# EAGLE design radio_rpi (EAGLE 7.5.0)
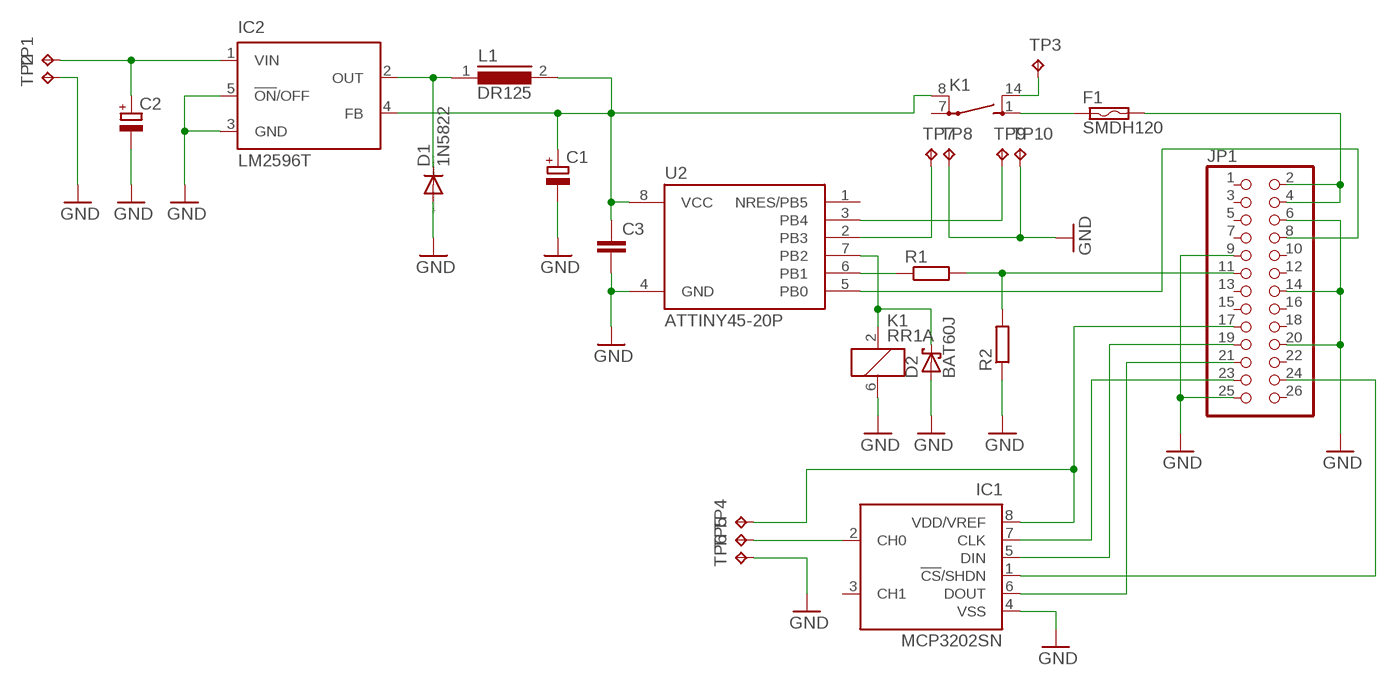
[diagram p0: schematic, sheet 1]

## Parts
C1  CPOL-EUUD-6,3X7,7  [UD-6,3X7,7_NICHICON]
C2  CPOL-EUUD-10X10  [UD-10X10_NICHICON]
C3  C-EUC1206K  [C1206K]
D1  1N5822  1N5624  [DO201-15]
D2  BAT60J  [SOD323_ST]
F1  SMDH120  [SMD050F]
IC1  MCP3202SN  [SO-08]
IC2  LM2596T  [T05D]
JP1  PINHD-2X13  [2X13]
K1  RR1A  [RR1A]
L1  DR125  [DR125]
R1  R-EU_M1206  [M1206]
R2  R-EU_M1206  [M1206]
TP1  TPTP20SQ  [TP20SQ]
TP2  TPTP20SQ  [TP20SQ]
TP3  TPTP20SQ  [TP20SQ]
TP4  TPTP20SQ  [TP20SQ]
TP5  TPTP20SQ  [TP20SQ]
TP6  TPTP20SQ  [TP20SQ]
TP7  TPTP20SQ  [TP20SQ]
TP8  TPTP20SQ  [TP20SQ]
TP9  TPTP20SQ  [TP20SQ]
TP10  TPTP20SQ  [TP20SQ]
U2  ATTINY45-20P  [PDIP08_300MIL]

## Nets
GND: C1.- C2.- C3.2 D1.A D2.A IC1.4(VSS) IC2.3(GND) IC2.5(!ON!/OFF) JP1.6 JP1.9 JP1.14 JP1.20 JP1.25 K1.6 R2.1 TP2.TP TP6.TP TP8.TP TP10.TP U2.4(GND)
N$1: F1.1 K1.1(2:S)
N$2: F1.2 JP1.2 JP1.4
N$3: C1.+ C3.1 IC2.4(FB) K1.8(2:P) L1.2 U2.8(VCC)
N$4: IC1.1(!CS!/SHDN) JP1.24
N$5: IC1.5(DIN) JP1.19
N$6: IC1.8(VDD/VREF) JP1.17 TP4.TP
N$7: IC1.7(CLK) JP1.23
N$8: IC1.2(CH0) TP5.TP
N$9: IC1.6(DOUT) JP1.21
N$10: JP1.8 U2.5(PB0)
N$11: JP1.11 R1.2 R2.2
N$12: D2.C K1.2 U2.7(PB2)
N$13: R1.1 U2.6(PB1)
N$14: K1.14(2:S) TP3.TP
N$15: C2.+ IC2.1(VIN) TP1.TP
N$16: TP7.TP U2.2(PB3)
N$17: D1.C IC2.2(OUT) L1.1
N$18: TP9.TP U2.3(PB4)
Unconnected: IC1.3(CH1) JP1.1 JP1.3 JP1.5 JP1.7 JP1.10 JP1.12 JP1.13 JP1.15 JP1.16 JP1.18 JP1.22 JP1.26 K1.7(2:P) U2.1(NRES/PB5)

## Library data of the parts
C1 C2 = rcl:CPOL-EU: POLARIZED CAPACITOR, European symbol
C3 = rcl:C-EU: CAPACITOR, European symbol
D1 = diode:1N5624: DIODE controlled avalanche rectifier
D2 = diode:BAT60J: Schottky barrier diode Source: www.st.com, BAT60J.pdf
F1 = switch-raychem:SMDH120: PolySwitch (TM) Resettable Device Source: Data sheet <http://www.farnell.com/datasheets/13482.pdf>
IC1 = microchip:MCP3202: 2.7V Dual Channel 12-Bit A/D Converter with SPI Serial Interface Source: http://ww1.microchip.com/downloads/en/DeviceDoc/21034D.pdf; MF: MICROCHIP; MPN: MCP3202-CI/SN; OC_FARNELL: 1196803; OC_NEWARK: 19C7207
IC2 = national-semiconductor:LM2596: SIMPLE SWITCHER® Power Converter 150 kHz 3A Step-Down Voltage Regulator Source: http://www.national.com/ds/LM/LM2596.pdf; MPN: LM2596T-ADJ/LF02; OC_FARNELL: 9494162; OC_NEWARK: 65K5910
JP1 = pinhead:PINHD-2X13: PIN HEADER
K1 = relay:RR1A: RELAY reed, polarity, 1 x norm. open with shield; OC_FARNELL: unknown; OC_NEWARK: unknown
L1 = inductors:DR125: High Power Density, High Efficiency, Shielded Inductors Source: coiltronics_dr_series.pdf
R1 R2 = resistor:R-EU_: RESISTOR, European symbol
TP1-TP10 = testpad:TP: Test pad
U2 = atmega-atxmega:ATTINY45*: ATMEL ATtiny 45 Packages: P = PDIP 08 30mil S = SOIC 08 EIAJ 208mil X = TSSOP 08 4.4mm Technologies Note: for complete ordering code (temp. range, finish, tape&reel etc.) see www.atmel.com • Supply Voltage: V = (1.8…5.5)V | [blank] = (2.7…5.5)V • Speed: 10 = 10 MHz | 20 = 20 MHz Author: Dipl.-Ing. FH Rainer Bayer HHN Hochschule Heilbronn (Heilbronn University), rainer.bayer@hs-heilbronn.de Ingenieurbüro ing-rb, mail@ing-rb.de

## Board
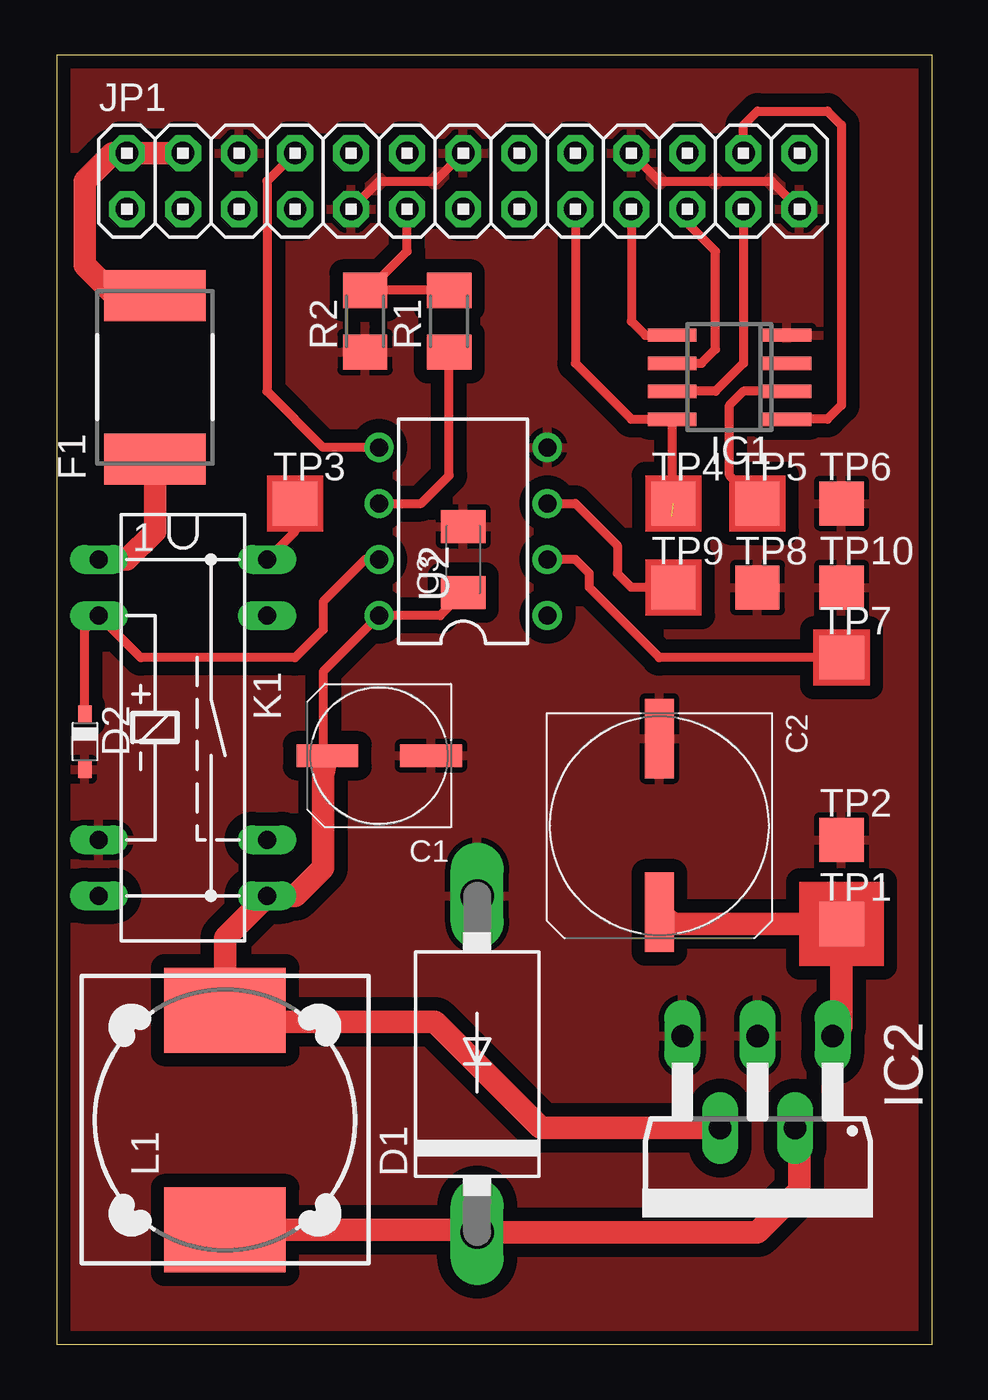
[diagram p1: board, top side]

Size 39.67 x 58.41 mm. Coordinates in mm from the lower left corner, seen from the top.
Outline: 0,0 39.67,0 39.67,58.41 0,58.41 0,0
Copper layers (1*16): Top 0.035mm / dielectric 1.5mm / Bottom 0.035mm
Design rules "default *": minimum track width 10mil, minimum drill 24mil, track to track 8mil, track to pad 8mil, pad to pad 8mil, via to via 8mil, smd to smd 8mil, copper to edge 20mil, drill to drill 8mil, minimum pad ring 10mil, minimum via ring 8mil, stop-mask expansion 4mil, vias tented up to drill 0mil, thermal gap 10mil

### Footprints (pad centres in the part's own frame; a part is rotated, then mirrored left to right if it is on the bottom)
UD-6,3X7,7_NICHICON = smd 2.8 x 1: + 2.35,0; - -2.35,0
UD-10X10_NICHICON = smd 3.6 x 1.3: + 3.925,0; - -3.95,0
C1206K = smd 1.5 x 2: 1 -1.5,0; 2 1.5,0
DO201-15 = drill 1.499 long: A 7.62,0; C -7.62,0
SOD323_ST = smd 0.8 x 0.6: A 1.25,0; C -1.25,0
SMD050F = smd 2.3 x 4.6: 1 -3.7,0; 2 3.7,0
SO-08 = smd 0.6 x 2.2: 1 -1.905,-2.6; 2 -0.635,-2.6; 3 0.635,-2.6; 4 1.905,-2.6; 5 1.905,2.6; 6 0.635,2.6; 7 -0.635,2.6; 8 -1.905,2.6
T05D = drill 1.016 long: 1 -3.404,-5.08; 2 -1.702,-0.914; 3 0,-5.08; 4 1.702,-0.914; 5 3.404,-5.08
2X13 = drill 1.016 octagon: 1 -15.24,-1.27; 2 -15.24,1.27; 3 -12.7,-1.27; 4 -12.7,1.27; 5 -10.16,-1.27; 6 -10.16,1.27; 7 -7.62,-1.27; 8 -7.62,1.27; 9 -5.08,-1.27; 10 -5.08,1.27; 11 -2.54,-1.27; 12 -2.54,1.27; 13 0,-1.27; 14 0,1.27; 15 2.54,-1.27; 16 2.54,1.27; 17 5.08,-1.27; 18 5.08,1.27; 19 7.62,-1.27; 20 7.62,1.27; 21 10.16,-1.27; 22 10.16,1.27; 23 12.7,-1.27; 24 12.7,1.27; 25 15.24,-1.27; 26 15.24,1.27
RR1A = drill 0.813 long: 1 -7.62,-3.81; 2 -5.08,-3.81; 6 5.08,-3.81; 7 7.62,-3.81; 8 7.62,3.81; 9 5.08,3.81; 13 -5.08,3.81; 14 -7.62,3.81
DR125 = smd 3.85 x 5.5: 1 -4.975,0; 2 4.975,0
M1206 = smd 1.6 x 2: 1 -1.4,0; 2 1.4,0
TP20SQ = smd 2 x 2: TP 0,0
PDIP08_300MIL = drill 0.813: 1 -3.81,-3.81; 2 -1.27,-3.81; 3 1.27,-3.81; 4 3.81,-3.81; 5 3.81,3.81; 6 1.27,3.81; 7 -1.27,3.81; 8 -3.81,3.81

### Placement (x,y rotation side)
C1  14.61,26.67 180 top
C2  27.3,23.5 270 top
C3  18.41,35.56 90 top
D1  19.05,12.7 90 top
D2  1.27,27.3 270 top
F1  4.45,43.81 90 top
IC1  30.48,43.81 90 top
IC2  31.75,8.89 180 top
JP1  18.41,52.7 0 top
K1  5.71,27.94 270 top
L1  7.62,10.16 90 top
R1  17.78,46.35 90 top
R2  13.97,46.35 90 top
TP1  35.56,19.05 0 top
TP2  35.56,22.86 0 top
TP3  10.79,38.1 0 top
TP4  27.94,38.1 0 top
TP5  31.75,38.1 0 top
TP6  35.56,38.1 0 top
TP7  35.56,31.11 0 top
TP8  31.75,34.29 0 top
TP9  27.94,34.29 0 top
TP10  35.56,34.29 0 top
U2  18.41,36.83 90 top

### Tracks (layer width: path | path; a pad name or v marks a point on that pad's centre or on a via)
GND
  Top 0.406: JP1.20 27.3,52.7 32.38,52.7 JP1.25 | JP1.9 14.61,52.7 17.14,52.7 JP1.14
  pour Top (isolate 0.61): 0,58.42 0,0 40.01,0 40.01,58.42
N$1
  Top 1.016: F1.1 4.45,36.83 3.17,35.56 K1.1
N$2
  Top 0.813: F1.2 2.65,47.52
  Top 1.016: JP1.4 JP1.2 2.54,53.98 1.27,52.7 1.27,48.9 2.65,47.52
N$3
  Top 0.406: 12.06,25.4 12.06,30.48 U2.8 17.38,33.02 C3.1
  Top 1.016: IC2.4 21.95,9.8 17.14,14.61 8.15,14.61 L1.2 7.62,18.41 K1.8 10.79,20.32 12.06,21.59 12.06,25.4 12.06,25.84 C1.+
N$4
  Top 0.406: JP1.24 31.11,55.24 31.75,55.88 34.92,55.88 35.56,55.24 35.56,42.55 34.92,41.91 IC1.1
N$5
  Top 0.406: JP1.19 26.04,46.35 26.67,45.72 IC1.5
N$6  (1 unrouted)
  Top 0.406: JP1.17 23.5,44.45 26.04,41.91 IC1.8 27.88,37.52
N$7
  Top 0.406: JP1.23 31.11,44.45 29.84,43.18 IC1.7
N$8
  Top 0.406: IC1.2 31.11,43.18 30.48,42.55 30.48,39.37 TP5.TP
N$9
  Top 0.406: IC1.6 29.21,44.45 29.84,45.09 29.84,49.53 28.57,50.8 JP1.21
N$10
  Top 0.406: JP1.8 9.53,52.7 9.53,43.18 12.06,40.64 U2.5
N$11
  Top 0.406: R1.2 14.73,47.76 14.61,47.62 | 14.61,47.62 14.61,48.26 15.88,49.53 JP1.11 | R2.2 14.47,47.76 14.61,47.62
N$12
  Top 0.406: U2.7 13.97,35.56 12.06,33.66 12.06,32.38 10.79,31.11 3.81,31.11 K1.2 1.27,32.38 D2.C
N$13
  Top 0.406: U2.6 16.51,38.1 17.78,39.37 R1.1
N$14
  Top 0.406: K1.14 10.79,36.83 TP3.TP
N$15
  Top 1.016: IC2.1 35.56,14.38 TP1.TP 27.94,19.05 C2.+
N$16
  Top 0.406: TP7.TP 27.3,31.11 24.13,34.29 24.13,34.92 23.5,35.56 U2.2
N$17
  Top 1.016: L1.1 18.31,5.18 D1.C 31.75,5.08 33.66,6.99 33.66,9.6 IC2.2
N$18
  Top 0.406: U2.3 23.5,38.1 25.4,36.2 25.4,34.92 26.04,34.29 TP9.TP
(copper drawn outside any net)
  shapes: Top area x6